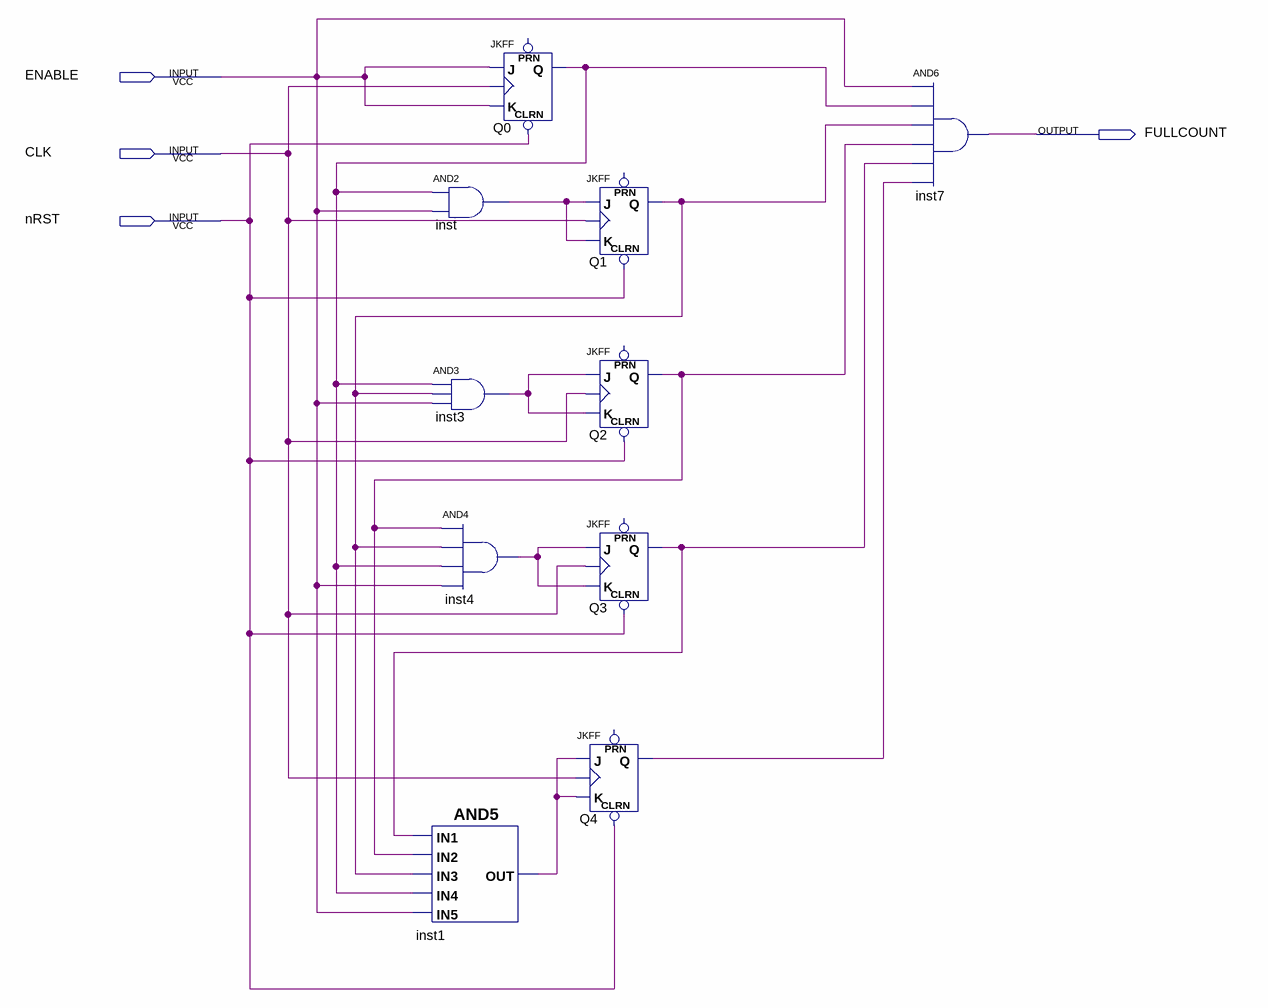
[diagram p0: schematic sheet]
// Quartus schematic Contadorciclos.bdf as structural Verilog: 10 symbols, 4 pins
module Contadorciclos (
  input  ENABLE,
  input  CLK,
  input  nRST,
  output FULLCOUNT
);

  wire inst1_out, inst3_out, inst4_out, inst_out, Q0_q, Q1_q, Q2_q, Q3_q, Q4_q;

  and inst (inst_out, Q0_q, ENABLE);
  and inst3 (inst3_out, Q0_q, Q1_q, ENABLE);
  and inst4 (inst4_out, Q2_q, Q1_q, Q0_q, ENABLE);
  and inst1 (inst1_out, Q3_q, Q2_q, Q1_q, Q0_q, ENABLE);
  JKFF Q0 (.CLRN(nRST), .K(ENABLE), .J(ENABLE), .CLK(CLK), .Q(Q0_q));  // open: PRN
  JKFF Q1 (.CLRN(nRST), .K(inst_out), .J(inst_out), .CLK(CLK), .Q(Q1_q));  // open: PRN
  JKFF Q2 (.CLRN(nRST), .K(inst3_out), .J(inst3_out), .CLK(CLK), .Q(Q2_q));  // open: PRN
  JKFF Q3 (.CLRN(nRST), .K(inst4_out), .J(inst4_out), .CLK(CLK), .Q(Q3_q));  // open: PRN
  JKFF Q4 (.CLRN(nRST), .K(inst1_out), .J(inst1_out), .CLK(CLK), .Q(Q4_q));  // open: PRN
  and inst7 (FULLCOUNT, ENABLE, Q0_q, Q1_q, Q2_q, Q3_q, Q4_q);
endmodule
